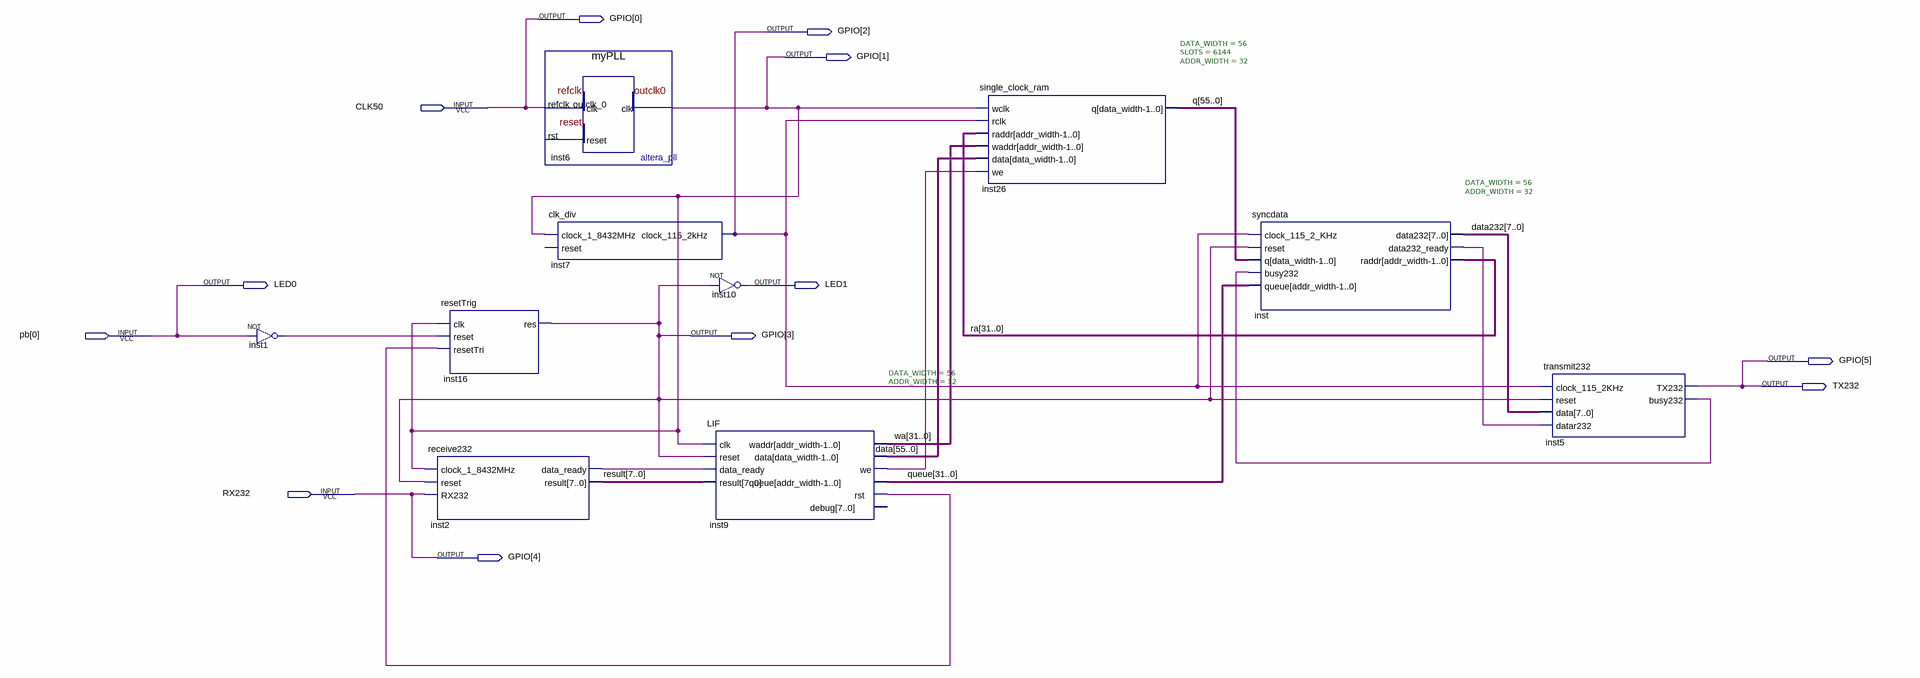
[diagram p0: schematic sheet]
// Quartus schematic ModelLibrary.bdf as structural Verilog: 10 symbols, 12 pins
module ModelLibrary (
  input  CLK50,
  input  [0:0] pb,
  input  RX232,
  output [5:0] GPIO,
  output LED0,
  output LED1,
  output TX232
);

  wire inst1_out, inst2_data_ready, inst5_busy232, inst9_rst, inst9_we, inst_data232_ready;
  wire [7:0] data232, result;
  wire [31:0] queue, ra, wa;
  wire [55:0] data, q;

  not inst1 (inst1_out, pb[0]);
  resetTrig inst16 (.clk(GPIO[1]), .reset(inst1_out), .resetTri(inst9_rst), .res(GPIO[3]));
  receive232 inst2 (
    .clock_1_8432MHz(GPIO[1]), .reset(GPIO[3]), .RX232(RX232), .data_ready(inst2_data_ready), .result(result));
  myPLL inst6 (.refclk(CLK50), .outclk_0(GPIO[1]));  // open: rst
  clk_div inst7 (.clock_1_8432MHz(GPIO[1]), .clock_115_2kHz(GPIO[2]));  // open: reset
  not inst10 (LED1, GPIO[3]);
  LIF #(.DATA_WIDTH(56), .ADDR_WIDTH(32)) inst9 (
    .clk(GPIO[1]), .reset(GPIO[3]), .data_ready(inst2_data_ready), .result(result), .waddr(wa), .data(data),
    .we(inst9_we), .queue(queue), .rst(inst9_rst));  // open: debug
  single_clock_ram #(.DATA_WIDTH(56), .SLOTS(6144), .ADDR_WIDTH(32)) inst26 (
    .wclk(GPIO[1]), .rclk(GPIO[2]), .raddr(ra), .waddr(wa), .data(data), .we(inst9_we), .q(q));
  syncdata #(.DATA_WIDTH(56), .ADDR_WIDTH(32)) inst (
    .clock_115_2_KHz(GPIO[2]), .reset(GPIO[3]), .q(q), .busy232(inst5_busy232), .queue(queue),
    .data232(data232), .data232_ready(inst_data232_ready), .raddr(ra));
  transmit232 inst5 (
    .clock_115_2KHz(GPIO[2]), .reset(GPIO[3]), .data(data232), .datar232(inst_data232_ready),
    .TX232(GPIO[5]), .busy232(inst5_busy232));

  assign {GPIO[4], GPIO[0]} = {RX232, CLK50};
  assign LED0 = pb[0];
  assign TX232 = GPIO[5];
endmodule
